# EAGLE design one key usb top (EAGLE 7.7.0)
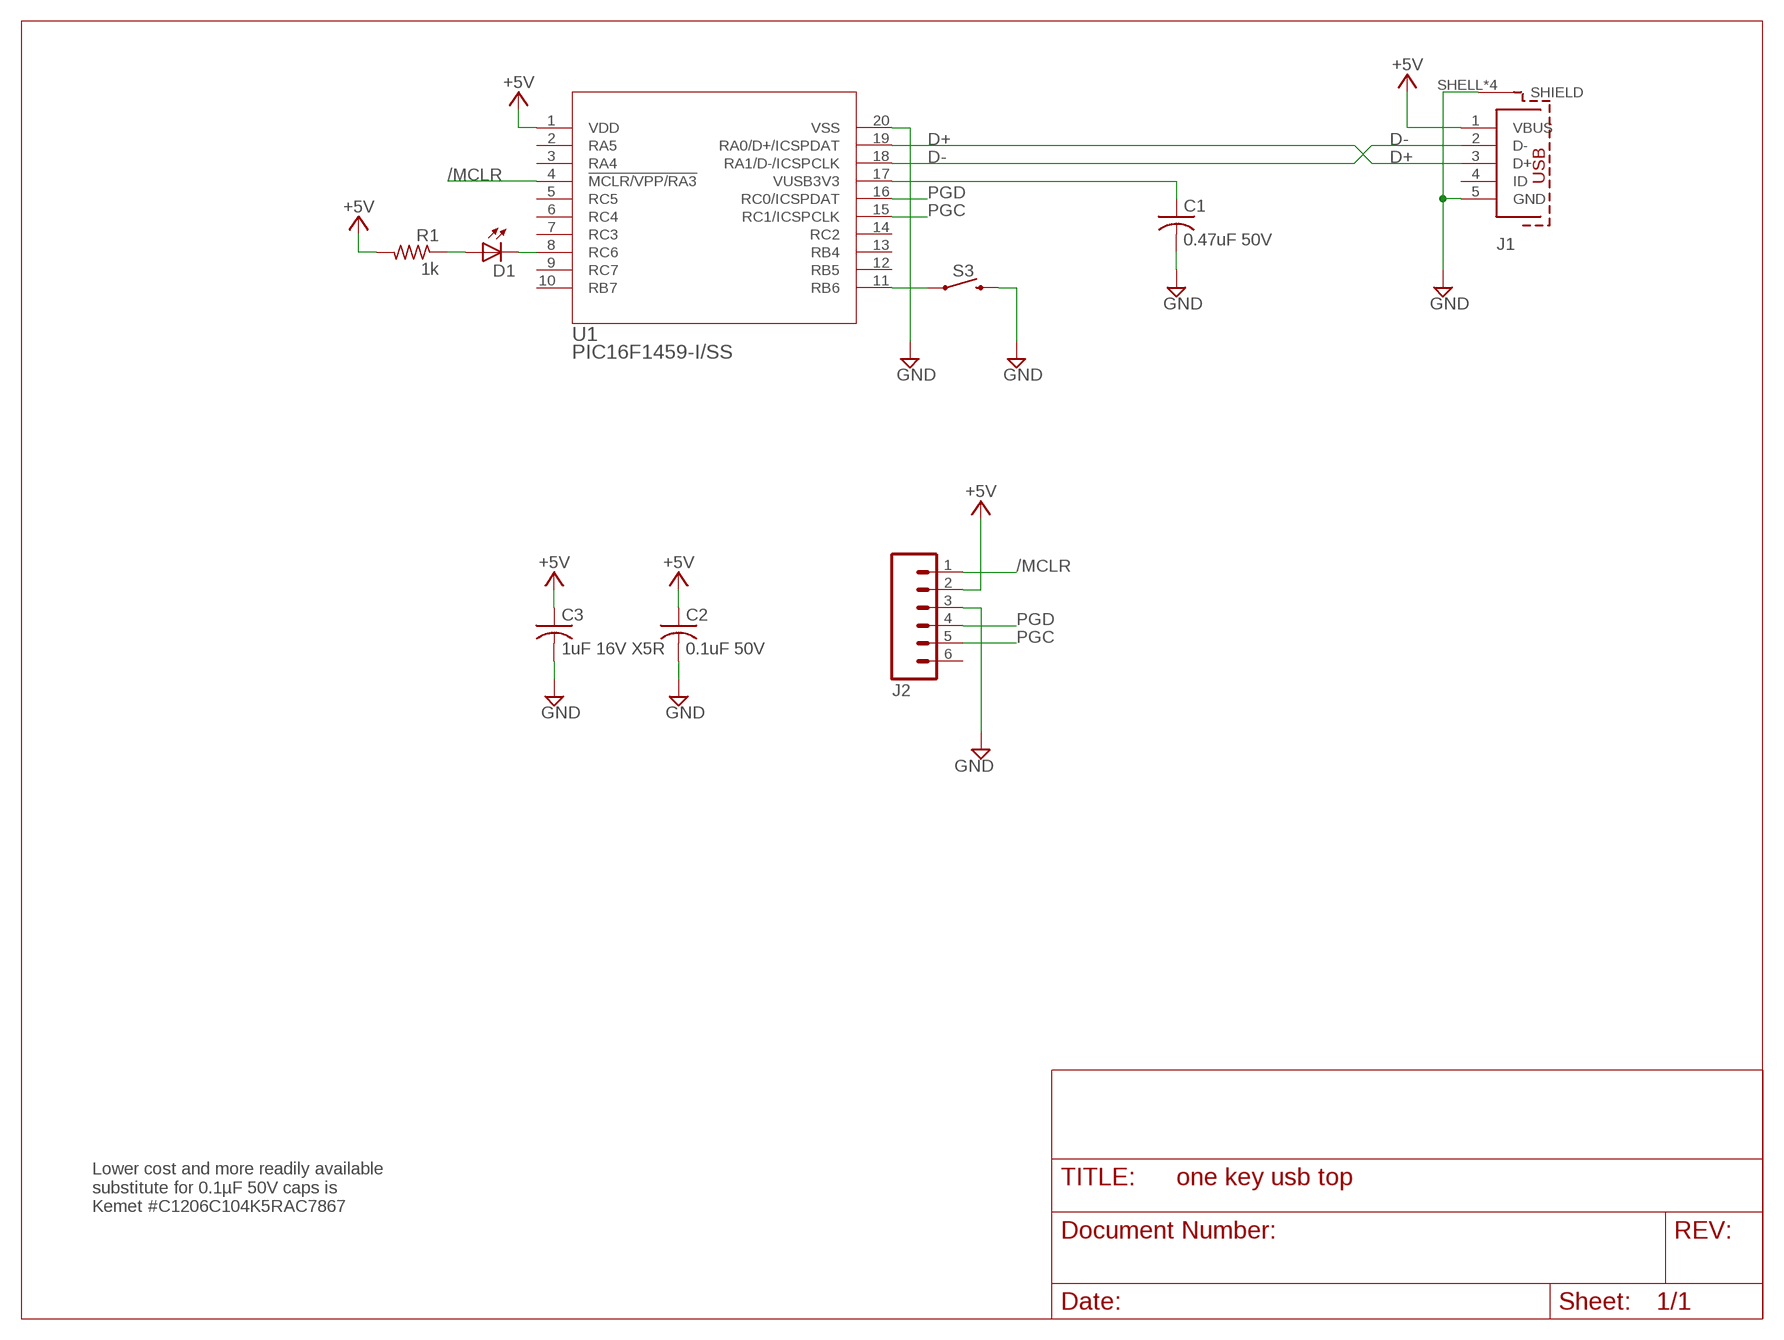
[diagram p0: schematic, sheet 1]

## Parts
C1  0.47uF 50V  C-USC1206K  [C1206K]
C2  0.1uF 50V  C-USC1206K  [C1206K]
C3  1uF 16V X5R  C-USC1210  [C1210]
D1  LEDKA-3528ASYC  [KA-3528ASYC]
J1  629105136821  [629105136821]
J2  M06SIP  [1X06]
R1  1k  R-US_R1206  [R1206]
S3  MOMENTARY-SWITCH-SPST  [CHERRY-MX-NOLED]
U1  PIC16F1459-I/SS  [SSOP20_MC]

## Nets
+5V: C2.1 C3.1 J1.1(VBUS) J2.2 R1.2 U1.1(VDD)
/MCLR: J2.1 U1.4(!MCLR/VPP/RA3)
D+: J1.3(D+) U1.19(RA0/D+/ICSPDAT)
D-: J1.2(D-) U1.18(RA1/D-/ICSPCLK)
GND: C1.2 C2.2 C3.2 J1.5(GND) J1.SHELL1(SHIELD) J1.SHELL2(SHIELD) J1.SHELL3(SHIELD) J1.SHELL(SHIELD) J2.3 S3.S2 U1.20(VSS)
N$3: D1.A R1.1
PGC: J2.5 U1.15(RC1/ICSPCLK)
PGD: J2.4 U1.16(RC0/ICSPDAT)
RB6: S3.S1 U1.11(RB6)
RC6: D1.C U1.8(RC6)
VUSB: C1.1 U1.17(VUSB3V3)
Unconnected: J1.4(ID) J2.6 U1.2(RA5) U1.3(RA4) U1.5(RC5) U1.6(RC4) U1.7(RC3) U1.9(RC7) U1.10(RB7) U1.12(RB5) U1.13(RB4) U1.14(RC2)

## Notes on the sheet
- Lower cost and more readily available
  substitute for 0.1µF 50V caps is
  Kemet #C1206C104K5RAC7867

## Library data of the parts
C1 = rcl:C-US: CAPACITOR, American symbol; MFR: KEMET; MFR_PART_NO: C1206C474K5RACTU
C2 = rcl:C-US: CAPACITOR, American symbol; MFR: KEMET; MFR_PART_NO: C1206S104M5RACTU
C3 = rcl:C-US: CAPACITOR, American symbol; MFR: KEMET; MFR_PART_NO: C1210C105K4PACTU
D1 = led:LED: LED OSRAM: - CHIPLED LG R971, LG N971, LY N971, LG Q971, LY Q971, LO R971, LY R971 LH N974, LH R974 LS Q976, LO Q976, LY Q976 LO Q996 - Hyper CHIPLED LW Q18S LB Q993, LB Q99A, LB R99A - SideLED LS A670, LO A670, LY A670, LG A670, LP A670 LB A673, LV A673, LT A673, LW A673 LH A674 LY A675 LS A676, LA A676, LO A676, LY A676, LW A676 LS A679, LY A679, LG A679 - Hyper Micro SIDELED® LS Y876, LA Y876, LO Y876, LY Y876 LT Y87S - SmartLED LW L88C, LW L88S LB L89C, LB L89S, LG L890 LS L89K, LO L89K, LY L89K LS L896, LA L896, LO L896, LY L896 - TOPLED LS T670, LO T670, LY T670, LG T670, LP T670 LSG T670, LSP T670, LSY T670, LOP T670, LYG T670 LG T671, LOG T671, LSG T671 LB T673, LV T673, LT T673, LW T673 LH T674 LS T676, LA T676, LO T676, LY T676, LB T676, LH T676, LSB T676, LW T676 LB T67C, LV T67C, LT T67C, LS T67K, LO T67K, LY T67K, LW E67C LS E67B, LA E67B, LO E67B, LY E67B, LB E67C, LV E67C, LT E67C LW T67C LS T679, LY T679, LG T679 LS T770, LO T770, LY T770, LG T770, LP T770 LB T773, LV T773, LT T773, LW T773 LH T774 LS E675, LA E675, LY E675, LS T675 LS T776, LA T776, LO T776, LY T776, LB T776 LHGB T686 LT T68C, LB T68C - Hyper Mini TOPLED® LB M676 - Mini TOPLED Santana® LG M470 LS M47K, LO M47K, LY M47K Source: http://www.osram.convergy.de LUXEON: - LUMILED® LXK2-PW12-R00, LXK2-PW12-S00, LXK2-PW14-U00, LXK2-PW14-V00 LXK2-PM12-R00, LXK2-PM12-S00, LXK2-PM14-U00 LXK2-PE12-Q00, LXK2-PE12-R00, LXK2-PE12-S00, LXK2-PE14-T00, LXK2-PE14-U00 LXK2-PB12-K00, LXK2-PB12-L00, LXK2-PB12-M00, LXK2-PB14-N00, LXK2-PB14-P00, LXK2-PB14-Q00 LXK2-PR12-L00, LXK2-PR12-M00, LXK2-PR14-Q00, LXK2-PR14-R00 LXK2-PD12-Q00, LXK2-PD12-R00, LXK2-PD12-S00 LXK2-PH12-R00, LXK2-PH12-S00 LXK2-PL12-P00, LXK2-PL12-Q00, LXK2-PL12-R00 Source: www.luxeon.com KINGBRIGHT: KA-3528ASYC Source: www.kingbright.com
J1 = InputOutputIO (rev18a):629105136821: WR-COM SMT Horizontal 5 Contacts Micro USB Type B,5 pins=>Code : Con_I-O_COM_MicroUSB_629105136821 <http://katalog.we-online.de/media/images/eican/Con_I-O_COM_MicroUSB_629105136821_pf2.jpg> Details see: http://katalog.we-online.de/en/em/COM_MICRO_SMT_TYPE_B_HORIZONTAL/629105136821?m Created 2014-07-09, Karrer Zheng 2014 (C) Würth Elektronik
J2 = SparkFun-Connectors:M06: Header 6 Standard 6-pin 0.1" header. Use with straight break away headers (SKU : PRT-00116), right angle break away headers (PRT-00553), swiss pins (PRT-00743), machine pins (PRT-00117), and female headers (PRT-00115). Molex polarized connector foot print use with SKU : PRT-08094 with associated crimp pins and housings. NOTES ON THE VARIANTS LOCK and LOCK_LONGPADS... This footprint was designed to help hold the alignment of a through-hole component (i.e. 6-pin header) while soldering it into place. You may notice that each hole has been shifted either up or down by 0.005 of an inch from it's more standard position (which is a perfectly straight line). This slight alteration caused the pins (the squares in the middle) to touch the edges of the holes. Because they are alternating, it causes a "brace" to hold the component in place. 0.005 has proven to be the perfect amount of "off-center" position when using our standard breakaway headers. Although looks a little odd when you look at the bare footprint, once you have a header in there, the alteration is very hard to notice. Also,if you push a header all the way into place, it is covered up entirely on the bottom side. This idea of altering the position of holes to aid alignment will be further integrated into the Sparkfun Library for other footprints. It can help hold any component with 3 or more connection pins.
R1 = rcl:R-US_: RESISTOR, American symbol; MFR: BOURNS; MFR_PART_NO: CR1206-JW-102ELF
S3 = SparkFun-Switches:MOMENTARY-SWITCH-SPST: Momentary Switch (Pushbutton) - SPST Normally-open (NO) SPST momentary switches (buttons, pushbuttons). Variants PTH-12MM - 12mm square, through-hole Momentary Pushbutton Switch - 12mm Square <https://www.sparkfun.com/products/9190> (COM-09190) PTH-6.0MM, PTH-6.0MM-KIT - 6.0mm square, through-hole Mini Pushbutton Switch <https://www.sparkfun.com/products/97> (COM-00097) KIT package intended for soldering kit's - only one side of pads' copper is exposed. PTH-RIGHT-ANGLE-KIT - Right-angle, through-hole Right Angle Tactile Button <https://www.sparkfun.com/products/10791> - Used on SparkFun BigTime Watch Kit <https://www.sparkfun.com/products/11734> SMD-12MM - 12mm square, surface-mount Tactile Button - SMD (12mm) <https://www.sparkfun.com/products/12993> (COM-12993) Used on SparkFun PicoBoard <https://www.sparkfun.com/products/11888> SMD-4.5MM - 4.5mm Square Trackball Switch Used on SparkFun Blackberry Trackballer Breakout <https://www.sparkfun.com/products/13169> SMD-4.6MMX2.8MM - 4.60mm x 2.80mm, surface mount Used on SparkFun SAMD21 Mini Breakout <https://www.sparkfun.com/products/13664> SMD-5.2MM, SMD-5.2-REDUNDANT - 5.2mm square, surface-mount Mini Pushbutton Switch - SMD <https://www.sparkfun.com/products/8720> (COM-08720) Used on Arduino Pro Mini <https://www.sparkfun.com/products/11114> REDUNDANT package connects both switch circuits together SMD-6.0X3.5MM - 6.0 x 3.5mm, surface mount Momentary Reset Switch SMD <https://www.sparkfun.com/products/8229> (COM-08229) SMD-6.2MM-TALL - 6.2mm square, surface mount Tactile Button - SMD (6mm) <https://www.sparkfun.com/products/12992> Used on SparkFun Digital Sandbox <https://www.sparkfun.com/products/12651> SMD-RIGHT-ANGLE - Right-angle, surface mount Used on SparkFun Block for Intel® Edison - Arduino <https://www.sparkfun.com/products/13036>
U1 = pic16f1459-i-ss:PIC16F1459-I/SS; MANUFACTURER_PART_NUMBER: PIC16F1459ISS; VENDOR: Microchip

## Board
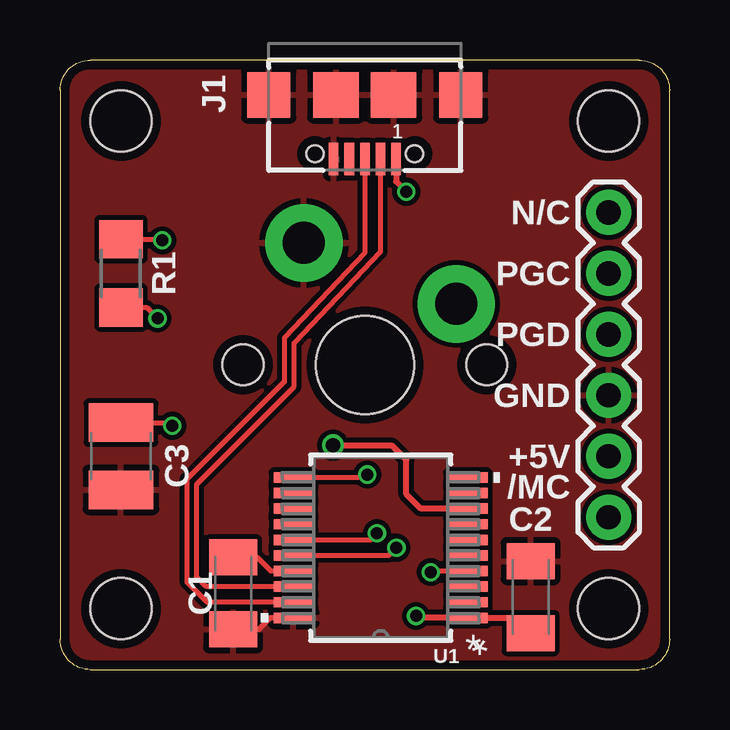
[diagram p1: board, top side]
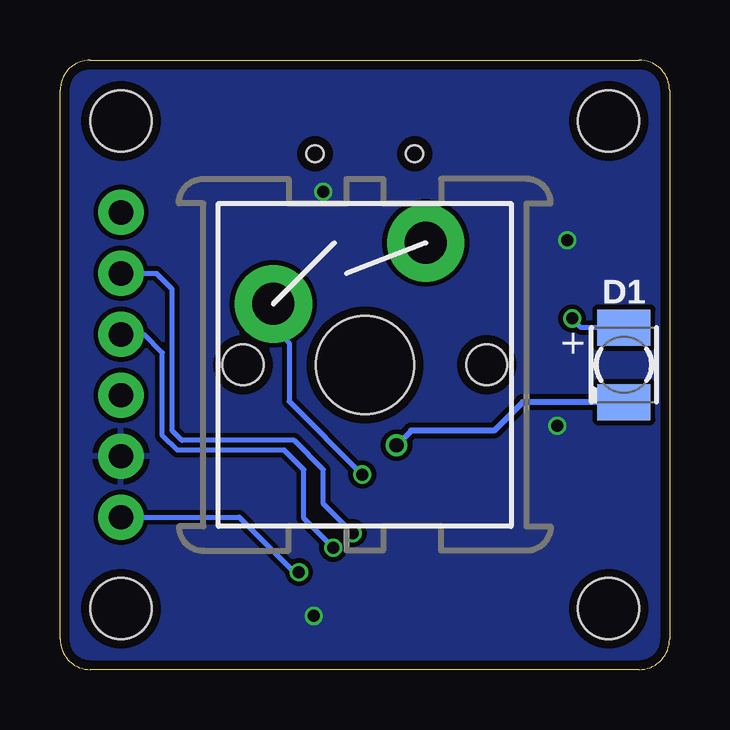
[diagram p2: board, bottom side, seen from below]

Size 25.4 x 25.4 mm. Coordinates in mm from the lower left corner, seen from the top.
Outline: 1.27,0 24.13,0 arc90 25.4,1.27 25.4,24.13 arc90 24.13,25.4 1.27,25.4 arc90 0,24.13 0,1.27 arc90 1.27,0
Copper layers (1*16): Top 0.035559375mm / dielectric 1.6mm / Bottom 0.035559375mm
Design rules "oshpark-2layer-2018": minimum track width 6mil, minimum drill 10mil, track to track 6mil, track to pad 6mil, pad to pad 6mil, via to via 6mil, smd to smd 6mil, copper to edge 15mil, drill to drill 6mil, minimum pad ring 5mil, minimum via ring 5mil, stop-mask expansion 2.5mil, vias tented up to drill 0mil, thermal gap 10mil
Holes 2.54 mm at 2.54,2.54 2.54,22.86 22.86,22.86 22.86,2.54

### Footprints (pad centres in the part's own frame; a part is rotated, then mirrored left to right if it is on the bottom)
C1206K = smd 1.5 x 2: 1 -1.5,0; 2 1.5,0
C1210 = smd 1.6 x 2.7: 1 -1.4,0; 2 1.4,0
KA-3528ASYC = smd 1.5 x 2.2: A -1.55,0; C 1.55,0
629105136821 = smd 0.4 x 1.35: 1 -1.3,2.675; 2 -0.65,2.675; 3 0,2.675; 4 0.65,2.675; 5 1.3,2.675 | smd 1.8 x 1.9: SHELL -4,0; SHELL3 4,0 | smd 1.9 x 1.9: SHELL1 -1.2,0; SHELL2 1.2,0 | hole 0.7: -2.075,2.45; 2.075,2.45
1X06 = drill 1.016 pad 1.88: 1 0,0; 2 2.54,0; 3 5.08,0; 4 7.62,0; 5 10.16,0; 6 12.7,0
R1206 = smd 1.6 x 1.803: 1 -1.422,0; 2 1.422,0
CHERRY-MX-NOLED = drill 1.753 pad 3.226: S1 -3.81,2.54; S2 2.54,5.08 | hole 4.089: 0,0 | hole 1.707: -5.08,0; 5.08,0
SSOP20_MC = smd 1.651 x 0.432: 1 -3.632,2.925; 2 -3.632,2.275; 3 -3.632,1.625; 4 -3.632,0.975; 5 -3.632,0.325; 6 -3.632,-0.325; 7 -3.632,-0.975; 8 -3.632,-1.625; 9 -3.632,-2.275; 10 -3.632,-2.925; 11 3.632,-2.925; 12 3.632,-2.275; 13 3.632,-1.625; 14 3.632,-0.975; 15 3.632,-0.325; 16 3.632,0.325; 17 3.632,0.975; 18 3.632,1.625; 19 3.632,2.275; 20 3.632,2.925

### Placement (x,y rotation side)
C1  7.21,3.17 270 top
C2  19.61,3.02 90 top
C3  2.54,8.89 270 top
D1  1.91,12.7 270 bottom
J1  12.7,23.95 180 top
J2  22.86,6.35 90 top
R1  2.54,16.51 90 top
S3  12.7,12.7 0 bottom
U1  13.36,5.08 180 top

### Tracks (layer width: path | path; a pad name or v marks a point on that pad's centre or on a via)
+5V  (via drill 0.5)
  Top 0.203: R1.2 4.22,17.93 v4.27,17.88 | C3.1 4.54,10.29 v4.67,10.16 | 18.98,2.15 C2.1
  Top 0.254: v14.83,2.23 14.91,2.15 U1.1 18.98,2.15 | J1.1 14,20.34 v14.43,19.91
  pour Bottom (isolate 0.203): 0,0 25.4,0 25.4,25.4 0,25.4
/MCLR  (via drill 0.5)
  Top 0.203: U1.4 15.48,4.11 v15.44,4.06
  Bottom 0.203: v15.44,4.06 15.65,4.06 17.93,6.35 J2.1
D+
  Top 0.203: U1.19 6.14,2.81 5.28,3.66 5.28,7.92 9.35,11.99 9.35,13.82 12.7,17.37 J1.3
D-
  Top 0.203: U1.18 6.09,3.46 5.69,3.86 5.69,7.72 9.75,11.79 9.75,13.61 13.35,17.41 J1.2
GND
  Top 0.203: C1.2 8.28,1.68 8.76,2.15 U1.20
  pour Top (isolate 0.203): 0,25.4 25.4,25.4 25.4,0 0,0
N$3  (via drill 0.5)
  Top 0.203: R1.1 3.61,15.09 v4.06,14.63
  Bottom 0.203: D1.A 3.68,14.25 v4.06,14.63
PGC  (via drill 0.5)
  Top 0.203: U1.15 12.92,5.41 v13.21,5.69
  Bottom 0.203: v13.21,5.69 14.43,6.91 14.43,8.33 15.65,9.55 20.32,9.55 20.73,9.96 20.73,15.85 21.39,16.51 J2.5
PGD  (via drill 0.5)
  Top 0.203: U1.16 13.7,4.75 v14.02,5.08
  Bottom 0.203: v14.02,5.08 14.83,5.89 15.24,6.3 15.24,8.33 16.05,9.14 20.52,9.14 21.13,9.75 21.13,13.21 21.89,13.97 J2.4
RB6  (via drill 0.5)
  Top 0.203: U1.11 12.68,8.01 v12.8,8.13
  Bottom 0.203: v12.8,8.13 15.85,11.18 15.85,13.61 16.51,14.28 S3.S1
RC6  (via drill 0.6)
  Top 0.254: U1.8 15.04,6.71 14.43,7.32 14.43,8.74 13.82,9.35 v11.38,9.35
  Bottom 0.254: D1.C 6.12,11.15 7.32,9.96 10.77,9.96 v11.38,9.35
VUSB
  Top 0.203: C1.1 8.23,4.67 8.8,4.11 U1.17

### Text on the board
_tsilk: J1 | 1 | N/C | R1 | PGC | PGD | GND | +5V | C3 | /MC | C2 | C1 | U1 | *
_bsilk: D1 | +